# EAGLE design BasicV2 (EAGLE 6.5.0)
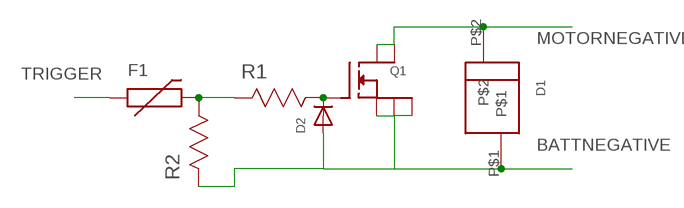
[diagram p0: schematic, sheet 1]

## Parts
D1  5.0SMDJ24ASMD  [DO-214AB]
D2  DIODESOD-123  [SOD-123]
F1  PTCSMD  [PTC-1206]
Q1  PSMN039LFPAC  [LFPAC]
R1  100 Ohm  ERJ-8ENF1800V  [RESC3216X71N]
R2  220 Ohm  ERJ-1TRQF1R0U  [RESC6332X71N]

## Nets
BATTNEGATIVE [large]: D1.P$1 D2.A Q1.1(S1) Q1.2(S2) Q1.3(S3) R2.2(R2)
MOTORNEGATIVE [large]: D1.P$2 Q1.5(D1) Q1.6(D2)
N$1: D2.C Q1.4(G) R1.1(R1)
N$2: F1.2 R1.2(R2) R2.1(R1)
TRIGGER: F1.1

## Library data of the parts
D1 = custom1:5.0SMDJ24A
D2 = adafruit:DIODE: Diode SMADIODE - SMA Surface Mount Package 20V 1A Schottky Diode Digikey: 641-1014-6-ND DO-1N4148 - Through Hole Small Current Diode SOD-123 20V 1 A (.5mV Vf) Schottky Diode - Digikey: MBRX120TPMSCT-ND SOD-323 10V 570mA (.38mV Vf, 3ns) Schottky Diode - Digikey: ZLLS410CT-ND SOD-523 30V 30mA Schottky Diode (RB751S-40TE61) - Digikey: RB751S-40TE61CT-ND SOT23-R/W - SOT23 Package (R = Solder Paste/Reflow Ovens, W = Hand-Soldering) BAT54Film 40V 300mA - Digikey: 497-7162-1-ND
F1 = SparkFun-PowerIC:PTC: Resettable Fuse PTC Resettable Fuse. Spark Fun Electronics SKU : COM-08357; PROD_ID: RES-11150
Q1 = lfpak mosfet:PSMN039: N-channel LFPAK 100 V 39.5 mΩ standard level MOSFET PSMN039-100YS General description Standard level N-channel MOSFET in LFPAK package qualified to 175 °C. This product is designed and qualified for use in a wide range of industrial, communications and domestic equipment. Features and benefits - Advanced TrenchMOS provides low RDSon and low gate charge - High efficiency gains in switching power converters - Improved mechanical and thermal characteristics - LFPAK provides maximum power density in a Power SO8 package Applications - DC-to-DC converters - Lithium-ion battery protection - Load switching - Motor control - Server power supplies Symbol Parameter Conditions Min Typ Max Unit VDS drain-source voltage Tj ≥ 25 °C; Tj ≤ 175 °C - - 100 V ID drain current Tmb = 25 °C; VGS = 10 V; - - 28.1 A Ptot total powerdissipation Tmb = 25 °C; - - 74 W Tj junction temperature -55 - 175 °C EDS(AL)S non-repetitive drain-source avalanche energy VGS = 10 V; Tj(init) = 25 °C; ID = 28.1 A; Vsup ≤ 100 V; unclamped; RGS = 50 Ω - - 42 mJ QGD gate-drain charge VGS = 10 V; ID = 15 A; VDS = 50 V; - 8 - nC QG(tot) total gate charge - 23 - nC; MPN: PSMN039-100YS; OC_FARNELL: 1845636; PACKAGE: LFPAC; SUPPLIER: NXP
R1 = Panasonic_By_element14_Batch_1:ERJ-8ENF1800V: RESISTOR, 1206; MPN: ERJ-8ENF1800V; OC_FARNELL: 1748422; OC_NEWARK: 64R5445; SUPPLIER: Panasonic; TOLERANCE: ±1 %; VALUE: 180 Ohm; WATTAGE: 0.25 W
R2 = Panasonic_By_element14_Batch_1:ERJ-1TRQF1R0U: RESISTOR, 2512; MPN: ERJ-1TRQF1R0U; OC_FARNELL: 1717958; OC_NEWARK: 15R1361; SUPPLIER: Panasonic; TOLERANCE: ± 1 %; VALUE: 1 Ohm; WATTAGE: 1 W

## Net classes
0 default: width 0.305 mm, drill 0.61 mm, clearance 0.305 mm
1 large: width 1 mm, drill 1.016 mm, clearance 0.4 mm

## Board
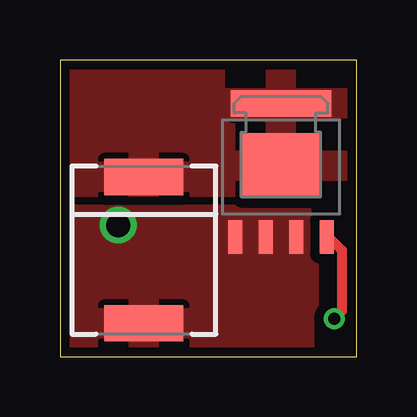
[diagram p1: board, top side]
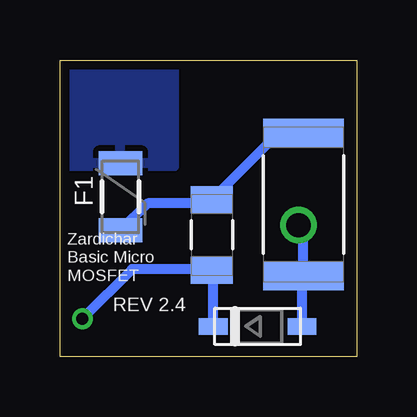
[diagram p2: board, bottom side, seen from below]

Size 12.36 x 12.37 mm. Coordinates in mm from the lower left corner, seen from the top.
Outline: 0,0 12.36,0 12.36,12.37 0,12.37 0,0
Copper layers (1*16): Top 0.0356mm / dielectric 1.5011mm / Bottom 0.0356mm
Design rules "OSHPark *": minimum track width 6mil, minimum drill 13mil, track to track 6mil, track to pad 6mil, pad to pad 6mil, via to via 6mil, smd to smd 6mil, copper to edge 15mil, drill to drill 6mil, minimum pad ring 7mil, minimum via ring 7mil, stop-mask expansion 3mil, vias tented up to drill 20mil, thermal gap 10mil

### Footprints (pad centres in the part's own frame; a part is rotated, then mirrored left to right if it is on the bottom)
DO-214AB = smd 1.5 x 3.3: P$1 -3.05,0; P$2 3.05,0
SOD-123 = smd 1.2 x 0.7: A 1.85,0; C -1.85,0
PTC-1206 = smd 1 x 1.8: 1 -1.4,0; 2 1.4,0
LFPAC = smd 0.6 x 1.4: 1 -1.905,-2.945; 2 -0.635,-2.945; 3 0.635,-2.945; 4 1.905,-2.945 | smd 4.2 x 1.1: 5 0,2.625 | smd 3.3 x 2.7: 6 0,0.025
RESC3216X71N = smd 1.118 x 1.753: 1 -1.473,0; 2 1.473,0
RESC6332X71N = smd 1.194 x 3.353: 1 -2.972,0; 2 2.972,0

### Placement (x,y rotation side)
D1  3.49,4.45 90 top
D2  4.13,1.27 0 bottom
F1  9.84,6.67 270 bottom
Q1  9.21,7.94 0 top
R1  6.03,5.08 90 bottom
R2  2.22,6.35 270 bottom

### Tracks (layer width: path | path; a pad name or v marks a point on that pad's centre or on a via)
BATTNEGATIVE  (via drill 1.02)
  Bottom 0.406: v2.43,5.49 2.22,5.28 R2.2 2.28,3.32 D2.A
  pour Top: 0.32,5.71 10.16,5.71 10.16,-0.64 0.32,-0.64
MOTORNEGATIVE
  pour Top: -0.32,13.34 12.38,13.34 12.38,7.3 -0.32,7.3
N$1  (via drill 0.51)
  Top 0.406: Q1.4 11.2,4.99 11.75,4.45 11.75,1.91 v11.43,1.59
  Bottom 0.305: 6.08,3.66 R1.1
  Bottom 0.406: D2.C 5.98,3.55 R1.1 | 6.08,3.66 9.36,3.66 v11.43,1.59
N$2
  Bottom 0.305: 6.08,6.4 R1.2 5.78,6.71 | 2.43,9.14 R2.1
  Bottom 0.406: 6.08,6.4 8.71,6.4 F1.2 | 2.43,9.14 3.44,9.14 R1.2
TRIGGER
  pour Bottom: 7.62,12.7 7.62,7.94 13.02,7.94 13.02,12.7

### Text on the board
bPlace: REV 2.4 | Zardichar / Basic Micro / MOSFET